# EasyEDA Pro project ProProject_基于CW32单片机的无刷电机控制器（旋转变压器位置反馈）_2024-06-02.epro, schematic Schematic2

## Sheets
1 P1_1: Create Date: 2024-05-21; Page Name: P1_1; Project Name: 基于CW32单片机的伺服电机控制器; Schematic Name: Schematic2; Update Date: 2024-05-25; Company: 嘉立创EDA; Page Size: A4; Version: V1.0
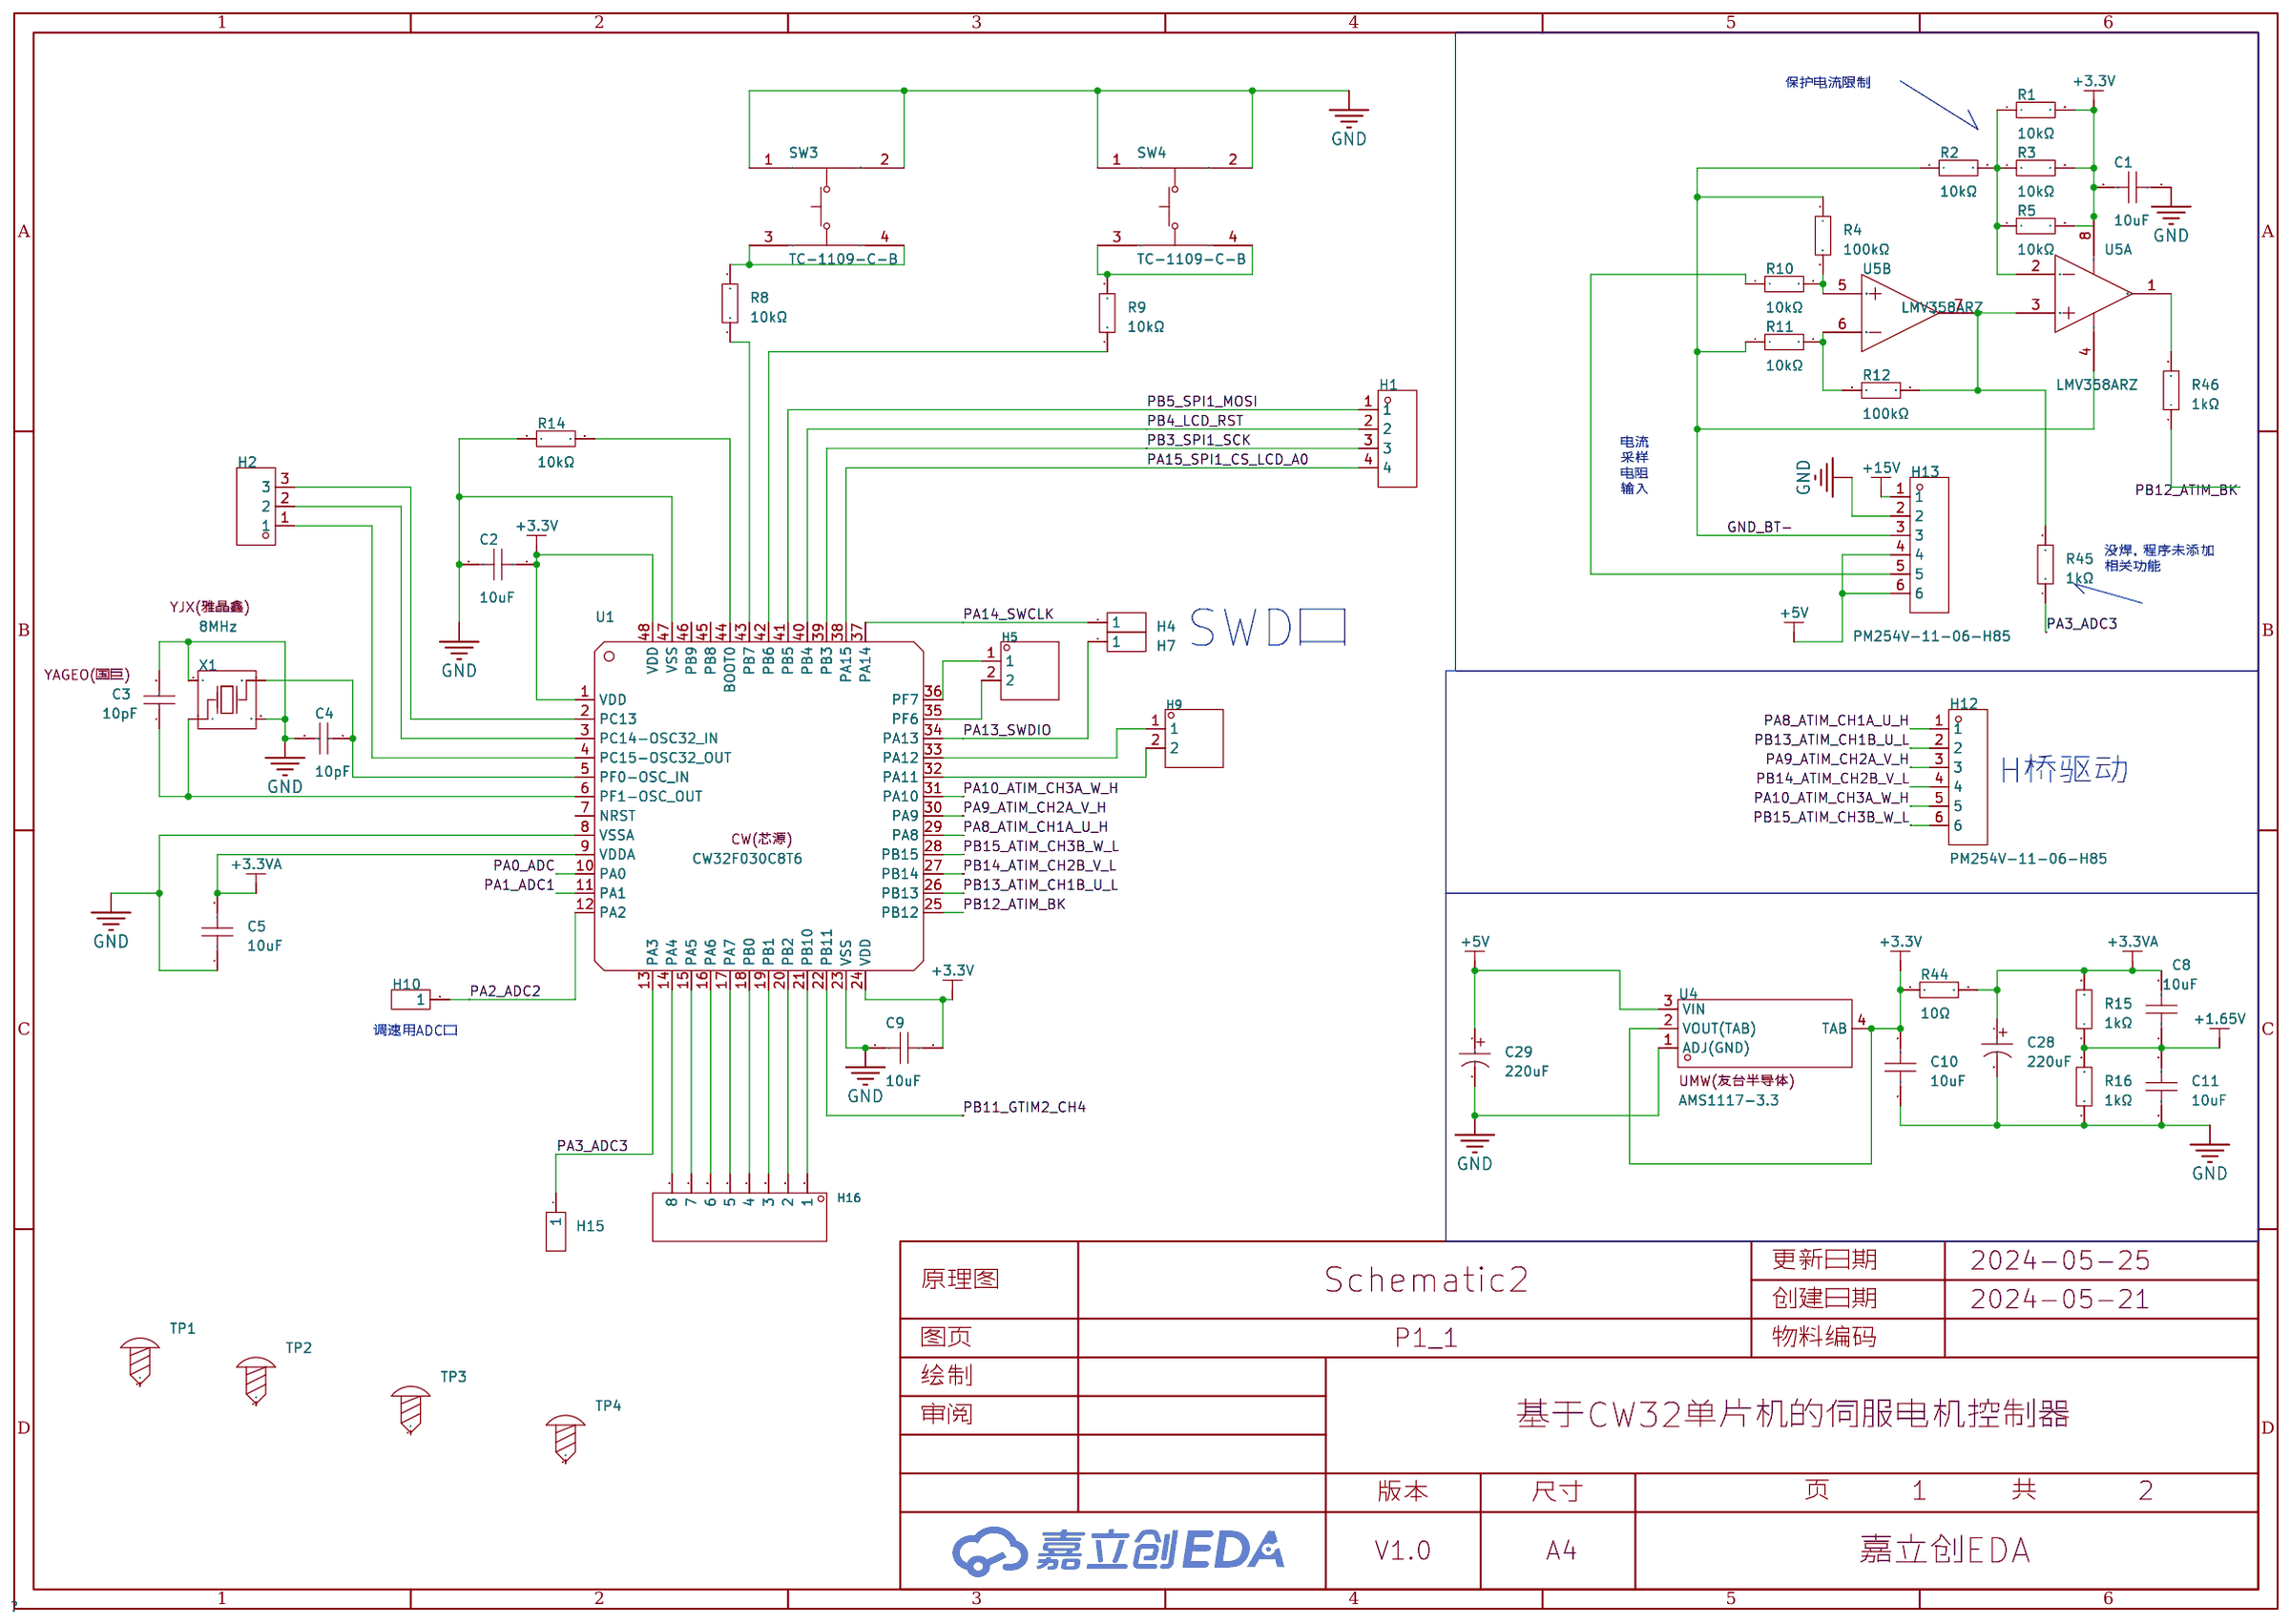
[diagram p0: P1_1]
2 P3: Create Date: 2024-05-25; Page Name: P3
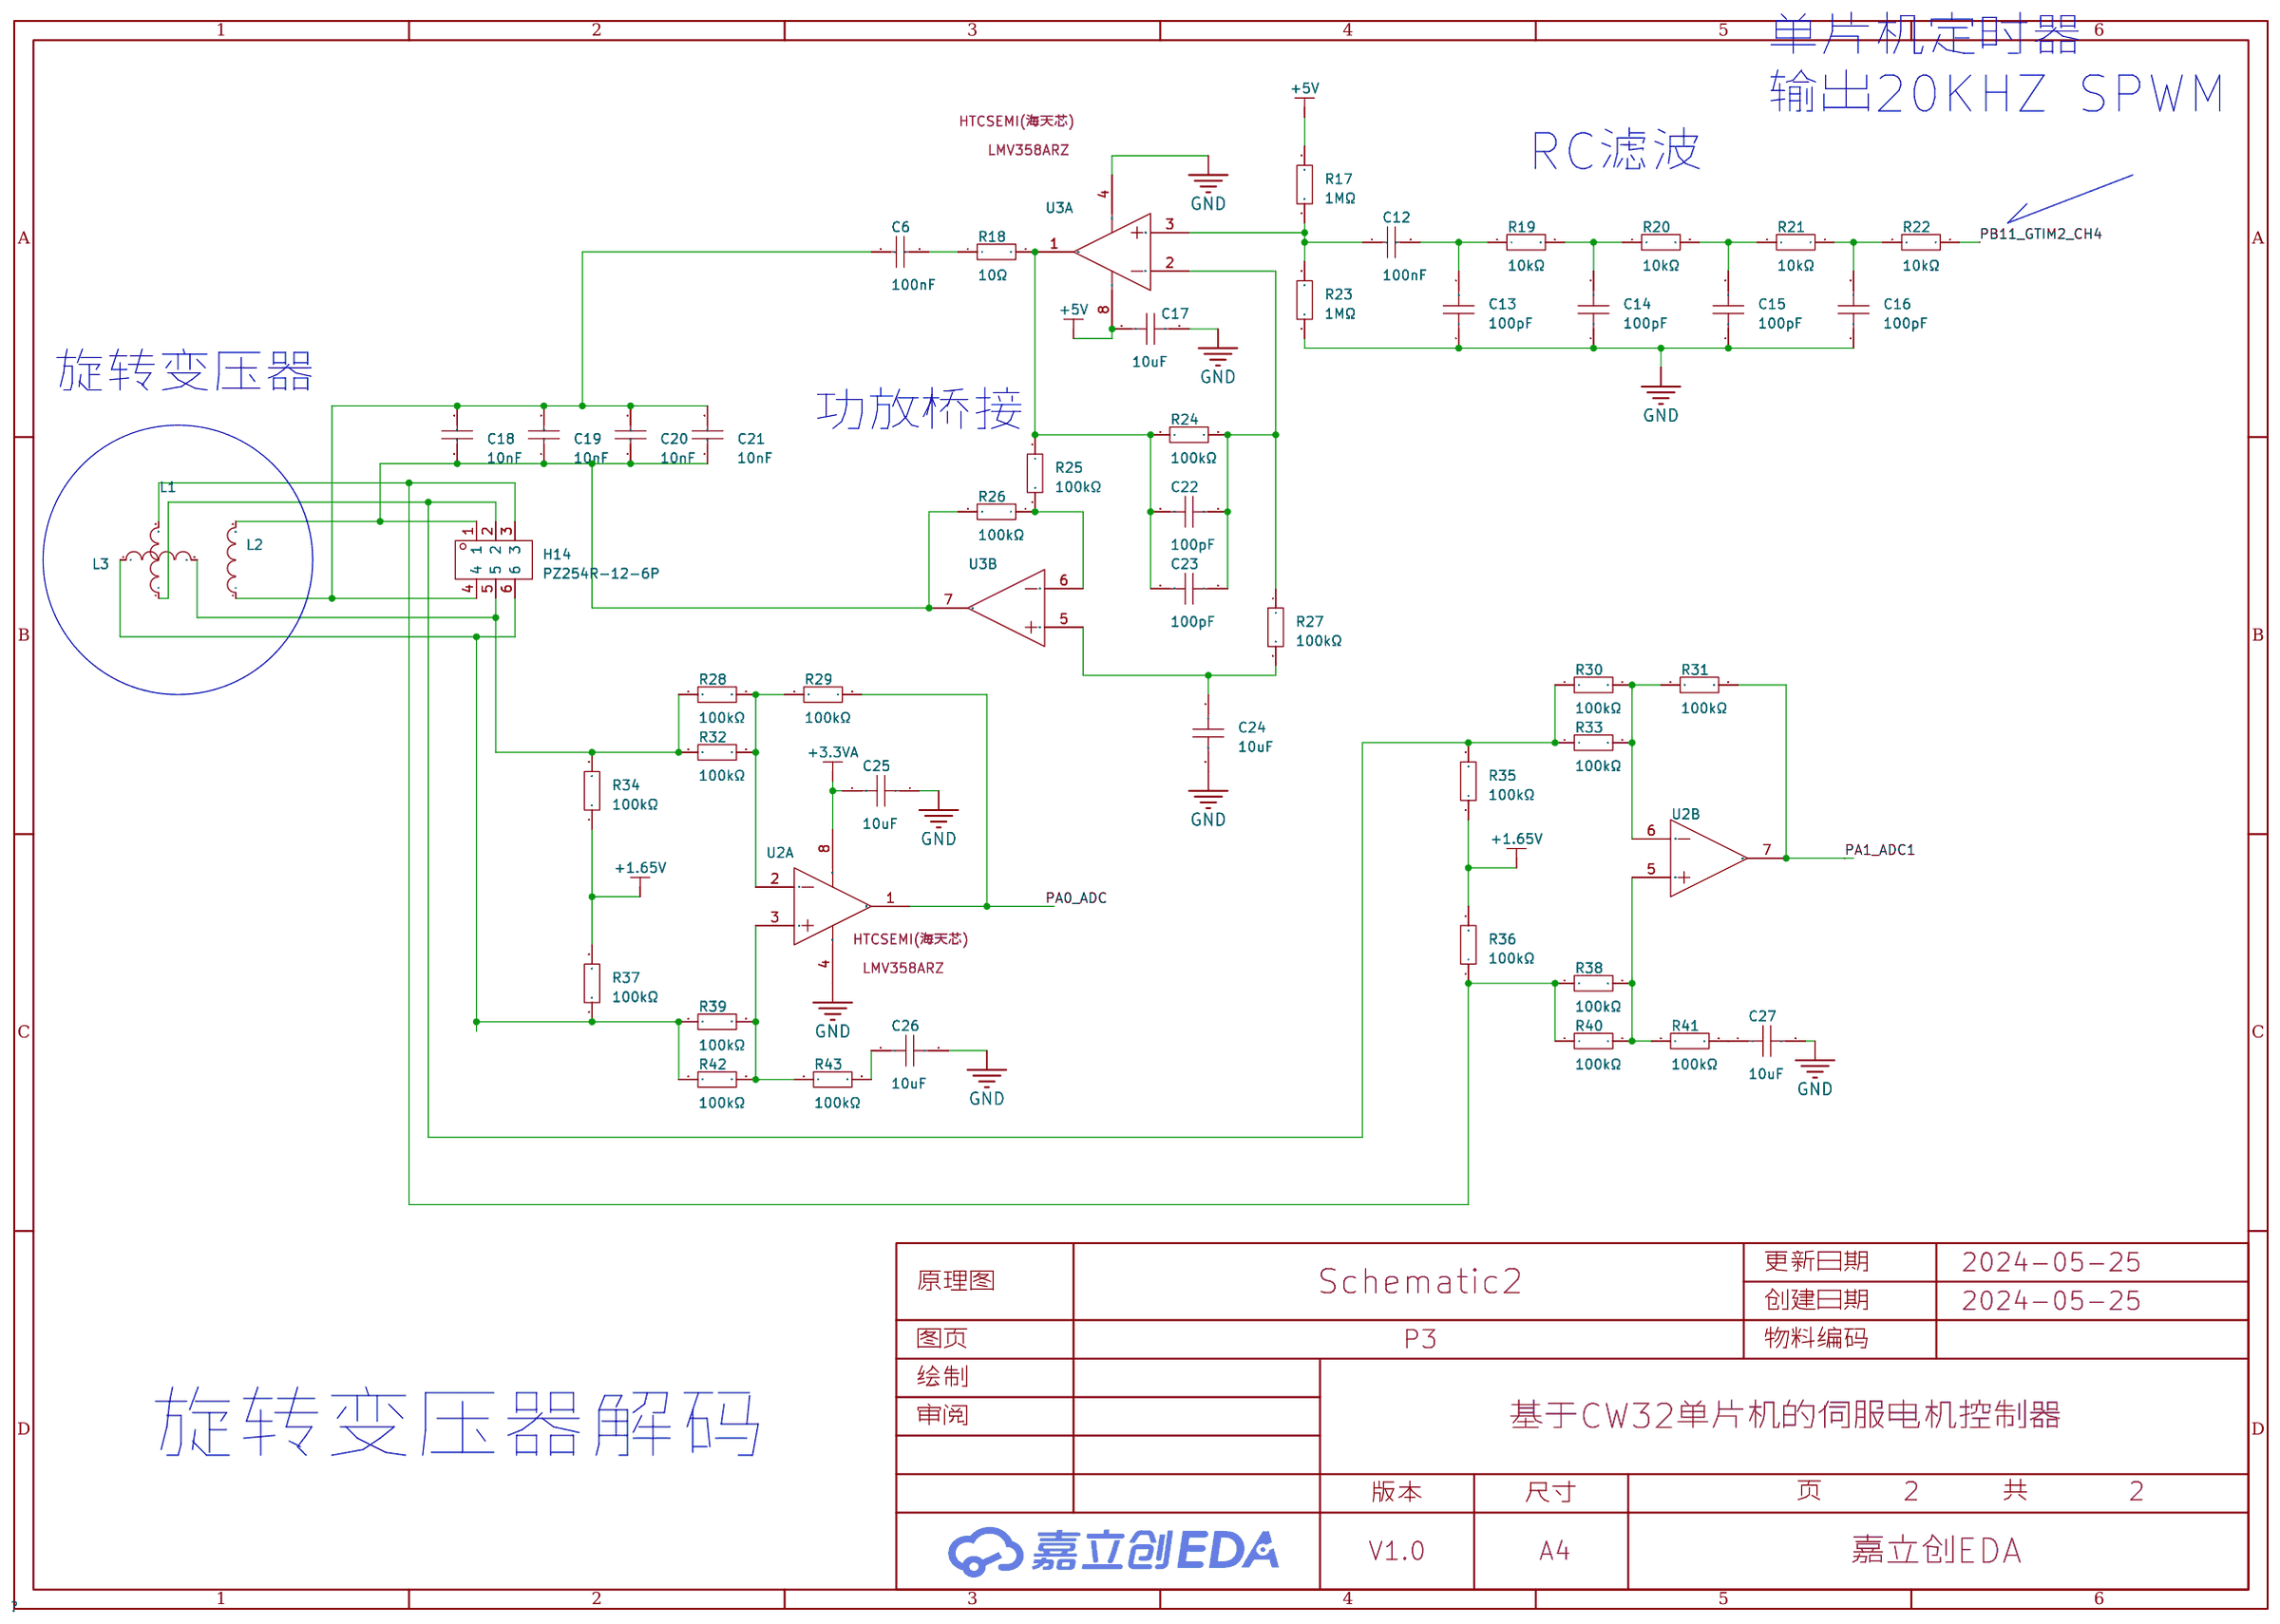
[diagram p1: P3]

## Parts
sheet P1_1
C1  10uF  [C0603]
C2  10uF  [C0603]
C3  10pF  [C0603]
C4  10pF  [C0603]
C5  10uF  [C0603]
C8  10uF  [C0603]
C9  10uF  [C0603]
C10  10uF  [C0603]
C11  10uF  [C0603]
C28  220uF  [CAP-SMD_BD6.3-L6.6-W6.6-LS7.2-R-RD]
C29  220uF  [CAP-SMD_BD6.3-L6.6-W6.6-LS7.2-R-RD]
H1  -  [HDR-TH_4P-P2.54-V-M]
H2  -  [HDR-TH_3P-P2.54-V-M]
H4  -  [HDR-TH_1P-V-M_XKB_X4611WV-01I-C28D40]
H5  -  [HDR-TH_2P-P2.54-V-M-1]
H7  -  [HDR-TH_1P-V-M_XKB_X4611WV-01I-C28D40]
H9  -  [HDR-TH_2P-P2.54-V-M-1]
H10  -  [HDR-TH_1P-V-M_XKB_X4611WV-01I-C28D40]
H12  PM254V-11-06-H85  [HDR-TH_6P-P2.54-V-F]
H13  PM254V-11-06-H85  [HDR-TH_6P-P2.54-V-F]
H15  -  [HDR-TH_1P-V-M_XKB_X4611WV-01I-C28D40]
H16  -  [HDR-TH_8P-P2.54-V-M]
R1  10kΩ  [R0603]
R2  10kΩ  [R0603]
R3  10kΩ  [R0603]
R4  100kΩ  [R0603]
R5  10kΩ  [R0603]
R8  10kΩ  [R0603]
R9  10kΩ  [R0603]
R10  10kΩ  [R0603]
R11  10kΩ  [R0603]
R12  100kΩ  [R0603]
R14  10kΩ  [R0603]
R15  1kΩ  [R0603]
R16  1kΩ  [R0603]
R44  10Ω  [R0603]
R45  1kΩ  [R0603]
R46  1kΩ  [R0603]
SW3  TC-1109-C-B  [KEY-TH_4P-L4.5-W4.5-P3.00-LS5.8]
SW4  TC-1109-C-B  [KEY-TH_4P-L4.5-W4.5-P3.00-LS5.8]
TP1  -  [M3螺丝]
TP2  -  [M3螺丝]
TP3  -  [M3螺丝]
TP4  -  [M3螺丝]
U1  CW32F030C8T6  [LQFP-48_L7.0-W7.0-P0.50-LS9.0-TL]
U4  AMS1117-3.3  [SOT-223-4_L6.5-W3.5-P2.30-LS7.0-BR]
U5  LMV358ARZ  [SOP-8_L4.9-W3.9-P1.27-LS6.0-BL]  (sections 1,2)
X1  8MHz  [OSC-SMD_4P-L3.2-W2.5-BL]
sheet P3
C6  100nF  [C0603]
C12  100nF  [C0603]
C13  100pF  [C0603]
C14  100pF  [C0603]
C15  100pF  [C0603]
C16  100pF  [C0603]
C17  10uF  [C0603]
C18  10nF  [C0603]
C19  10nF  [C0603]
C20  10nF  [C0603]
C21  10nF  [C0603]
C22  100pF  [C0603]
C23  100pF  [C0603]
C24  10uF  [C0603]
C25  10uF  [C0603]
C26  10uF  [C0603]
C27  10uF  [C0603]
H14  PZ254R-12-6P  [HDR-TH_6P-P2.54-H-M-R2-C3-S2.54]
L1  10uH  [L1206]
L2  6.3uH  [L1206]
L3  10uH  [L1206]
R17  1MΩ  [R0603]
R18  10Ω  [R0603]
R19  10kΩ  [R0603]
R20  10kΩ  [R0603]
R21  10kΩ  [R0603]
R22  10kΩ  [R0603]
R23  1MΩ  [R0603]
R24  100kΩ  [R0603]
R25  100kΩ  [R0603]
R26  100kΩ  [R0603]
R27  100kΩ  [R0603]
R28  100kΩ  [R0603]
R29  100kΩ  [R0603]
R30  100kΩ  [R0603]
R31  100kΩ  [R0603]
R32  100kΩ  [R0603]
R33  100kΩ  [R0603]
R34  100kΩ  [R0603]
R35  100kΩ  [R0603]
R36  100kΩ  [R0603]
R37  100kΩ  [R0603]
R38  100kΩ  [R0603]
R39  100kΩ  [R0603]
R40  100kΩ  [R0603]
R41  100kΩ  [R0603]
R42  100kΩ  [R0603]
R43  100kΩ  [R0603]
U2  -  [SOP-8_L4.9-W3.9-P1.27-LS6.0-BL]  (sections 1,2)
U3  -  [SOP-8_L4.9-W3.9-P1.27-LS6.0-BL]  (sections 1,2)

## Library data of the parts
C1 C2 C5 C8-C11 C17 C24-C27 = CL10A106KP8NNNC: 容值:10uF;精度:±10%;额定电压:10V;材质(温度系数):X5R;; LCSC Part Name: 10uF ±10% 10V; Supplier Part: C19702; Manufacturer: SAMSUNG(三星); Supplier Footprint: 0603; JLCPCB Part Class: 基础库; Datasheet: https://atta.szlcsc.com/upload/public/pdf/source/20160218/1457707763339.pdf; Supplier: LCSC; Tolerance: ±10%; Voltage Rated: 10V; Temperature Coefficient: X5R
C3 C4 = CC0603JRNPO9BN100: 容值:10pF;精度:±5%;额定电压:50V;材质(温度系数):NP0;; LCSC Part Name: 10pF ±5% 50V; Supplier Part: C106245; Manufacturer: YAGEO(国巨); Supplier Footprint: 0603; JLCPCB Part Class: 扩展库; Datasheet: https://atta.szlcsc.com/upload/public/pdf/source/20170505/1493957838062.pdf; Supplier: LCSC; Tolerance: ±5%; Voltage Rated: 50V; Temperature Coefficient: NP0
C28 C29 = RVT1A221M0605: 容值:220uF;精度:±20%;额定电压:10V;纹波电流:-;等效串联电阻:-;; LCSC Part Name: 220uF ±20% 10V; Supplier Part: C3345; Manufacturer: HONOR(荣誉); Supplier Footprint: SMD,D6.3xL5.4mm; JLCPCB Part Class: 扩展库; Datasheet: https://atta.szlcsc.com/upload/public/pdf/source/20220520/1BCC52842751E84E020A4D0B70BC5F88.pdf; Supplier: LCSC; Tolerance: ±20%; Rated Voltage: 10V; φD: 6.3mm; L: 5.4mm; Lifetime @ Temp: 2000hrs@105℃; Operating Temperature: -55℃~+105℃
H1 = HDR-M_2.54_1x4P: Supplier Part: C492403; Supplier Footprint: 插件
H2 = HDR-M_2.54_1x3P: Supplier Part: C2937625; Supplier Footprint: 插件
H4 H7 H10 H15 = HDR-M_2.54_1x1P: Supplier Part: C81276; Supplier Footprint: 插件; JLCPCB Part Class: Extended Part
H5 H9 = HDR-M_2.54_1x2P: Supplier Part: C124375; Supplier Footprint: 插件
H12 H13 = PM254V-11-06-H85: 插孔结构:1x6P;间距:2.54mm;行距:-;圆孔/方孔:方孔;安装类型:直插;排数:单排;总孔位数:6P;额定电流:3A;额定电压:250V;插孔方向:顶部;塑高:-;工作温度范围:-40℃~+105℃;; LCSC Part Name: 间距:2.54mm 1x6P 直插; Supplier Part: C2832269; Manufacturer: XFCN(兴飞); Supplier Footprint: 插件,P=2.54mm; JLCPCB Part Class: 扩展库; Datasheet: https://atta.szlcsc.com/upload/public/pdf/source/20210514/C2832269_B3EC97736B37C2783BDCE3050AA57447.pdf; Supplier: LCSC; Holes Structure: 1x6P; Pitch: 2.54mm; Circular Hole / Square Hole: 方孔; Mounting Type: 直插; Number of Rows: 单排; Number of Holes: 6P; Current Rating (Max): 3A; Voltage Rating (Max): 250V; Holes Direction: 顶部; Operating Temperature Range: -40℃~+105℃
H16 = HDR-M_2.54_1x8P: Supplier Part: C124381; Supplier Footprint: 插件
R1-R3 R5 R8-R11 R14 R19-R22 = RC0603FR-0710KL: 电阻类型:厚膜电阻;阻值:10kΩ;精度:±1%;功率:100mW;最大工作电压:75V;温度系数:±100ppm/℃;; LCSC Part Name: 厚膜电阻 10kΩ ±1% 100mW; Supplier Part: C98220; Manufacturer: YAGEO(国巨); Supplier Footprint: 0603; JLCPCB Part Class: 扩展库; Datasheet: https://atta.szlcsc.com/upload/public/pdf/source/20180927/C295883_E8D83085EA81BD7DE0B2B681138C15EE.pdf; Supplier: LCSC; Type: 厚膜电阻; Tolerance: ±1%; Power(Watts): 100mW; Overload Voltage (Max): 75V; Temperature Coefficient: ±100ppm/℃; Operating Temperature Range: -55℃~+155℃
R4 R12 R24-R43 = RC0603FR-07100KL: 电阻类型:厚膜电阻;阻值:100kΩ;精度:±1%;功率:100mW;最大工作电压:75V;温度系数:±100ppm/℃;; LCSC Part Name: 厚膜电阻 100kΩ ±1% 100mW; Supplier Part: C14675; Manufacturer: YAGEO(国巨); Supplier Footprint: 0603; JLCPCB Part Class: 扩展库; Datasheet: https://atta.szlcsc.com/upload/public/pdf/source/20140324/1457707028752.pdf; Supplier: LCSC; Type: 厚膜电阻; Tolerance: ±1%; Power(Watts): 100mW; Overload Voltage (Max): 75V; Temperature Coefficient: ±100ppm/℃; Operating Temperature Range: -55℃~+155℃
R15 R16 R45 R46 = RC0603FR-071KL: 电阻类型:厚膜电阻;阻值:1kΩ;精度:±1%;功率:100mW;最大工作电压:75V;温度系数:±100ppm/℃;; LCSC Part Name: 厚膜电阻 1kΩ ±1% 100mW; Supplier Part: C22548; Manufacturer: YAGEO(国巨); Supplier Footprint: 0603; JLCPCB Part Class: 扩展库; Datasheet: https://atta.szlcsc.com/upload/public/pdf/source/20180316/70C0E2BDAE7FCC62C531A5A58D202EE1.pdf; Supplier: LCSC; Type: 厚膜电阻; Tolerance: ±1%; Power(Watts): 100mW; Overload Voltage (Max): 75V; Temperature Coefficient: ±100ppm/℃; Operating Temperature Range: -55℃~+155℃
R18 R44 = 0603WAF100JT5E: 电阻类型:厚膜电阻;阻值:10Ω;精度:±1%;功率:100mW;最大工作电压:75V;温度系数:±400ppm/℃;; LCSC Part Name: 10Ω ±1% 100mW 厚膜电阻; Supplier Part: C22859; Manufacturer: UNI-ROYAL(厚声); Supplier Footprint: 0603; JLCPCB Part Class: 基础库; Datasheet: https://atta.szlcsc.com/upload/public/pdf/source/20200306/C422600_1E6D84923E4A46A82E41ADD87F860B5C.pdf; Supplier: LCSC; Type: 厚膜电阻; Tolerance: ±1%; Power(Watts): 100mW; Overload Voltage (Max): 75V; Temperature Coefficient: ±400ppm/℃; Operating Temperature Range: -55℃~+155℃
SW3 SW4 = TC-1109-C-B: 电路结构:单刀单掷;按钮形状:圆形按钮;作用力:260gf;安装方式:直插;开关长度:4.5mm;开关宽度:4.5mm;开关高度:4.3mm;带支架:不带;触点电流:50mA;额定电压(DC):12V;绝缘电阻:-;带灯:无;机械寿命:10万次;; LCSC Part Name: 4.5*4.5*4.3mm 直插 轻触开关; Supplier Part: C381028; Manufacturer: XKB Connectivity(中国星坤); Supplier Footprint: 插件; JLCPCB Part Class: 扩展库; Datasheet: https://atta.szlcsc.com/upload/public/pdf/source/20200227/C381029_60190E4BA5E8CCEE2F9455ADEE779639.pdf; Supplier: LCSC; Circuit: 单刀单掷; Actuator Style: 圆形按钮; Operating Force: 260gf; Mounting Style: 直插; Switch Length: 4.5mm; Switch Width: 4.5mm; Switch Height: 4.3mm; Strike Gundam: 不带; Contact Current: 50mA; Voltage Rating (DC): 12V; Actuator/Cap Color: 黑色; With Lamp: 无; Pin Style: PC引脚; Mechanical Life: 10万次; Operating Temperature: -30℃~+85℃
TP1-TP4 = M3螺丝: Supplier Footprint: 插件
U1 = CW32F030C8T6_C3019113: CPU内核:ARM-M系列;RAM总容量:8KB;GPIO端口数量:39;工作电压范围:1.65V~5.5V;CPU最大主频:64MHz;程序存储器类型:-;; Supplier Part: C3019113; Manufacturer: CW(芯源); Supplier Footprint: LQFP-48(7x7); JLCPCB Part Class: 扩展库; Datasheet: https://atta.szlcsc.com/upload/public/pdf/source/20220516/D60F5E1023A73FFF550D4A77416DDFBC.pdf; Supplier: LCSC; CPU Core: ARM-M系列; RAM Size: 8KB; GPIO Ports Number: 39; Operating Voltage Range: 1.65V~5.5V; CPU Maximum Speed: 64MHz; Operating Temperature Range: -40℃~+105℃; ADC (Bit): 12bit; 16Bit Timer: 8; UART/USART: 3; I2C: 2; SPI: 2; Internal Comparator: 有; Peripheral/Function: 片载温度传感器；DMA；看门狗；低电压检测；CRC校验; Watchdog: 有; Low-Voltage Detect: 有; Direct Memory Access: 有
U4 = AMS1117-3.3_C347222: 输出类型:固定;最大输入电压:12V;输出电压:3.3V;最大输出电流:1A;电源纹波抑制比(PSRR):60dB@(120Hz);输出极性:正极;; LCSC Part Name: 输出:3.3V 电流:1A 耐压:12V; Supplier Part: C347222; Manufacturer: UMW(友台半导体); Supplier Footprint: SOT-223; JLCPCB Part Class: 扩展库; Datasheet: https://atta.szlcsc.com/upload/public/pdf/source/20231109/155D79A26D9DB04352555A58D5969DC8.pdf; Supplier: LCSC; Output Type: 固定; Maximum Input Voltage: 12V; Output Voltage: 3.3V; MAX Output Current: 1A; Power Supply Rejection Ratio (PSRR): 60dB@(120Hz); Dropout Voltage: 1.3V@(1A); Output Polarity: 正极; Number of Outputs: 1
U2 U3 U5 = LMV358ARZ: 放大器数:双路;; Supplier Part: C2928823; Manufacturer: HTCSEMI(海天芯); Supplier Footprint: SOP-8; JLCPCB Part Class: 扩展库; Datasheet: https://atta.szlcsc.com/upload/public/pdf/source/20220114/2D4B849A76DE33264688A93B3A90A0F8.pdf; Supplier: LCSC; Number of Circuits: 双路
X1 = TAXM8M4RDBCCT2T: 晶振类型:贴片晶振;频率:8MHz;常温频差:±10ppm;外接负载电容:10pF;频率稳定度(全温):±15ppm;; LCSC Part Name: 8MHz ±10ppm 10pF; Supplier Part: C400090; Manufacturer: YJX(雅晶鑫); Supplier Footprint: SMD3225-4P; JLCPCB Part Class: 扩展库; Datasheet: https://atta.szlcsc.com/upload/public/pdf/source/20190626/C400090_CF95B89E745AFE4EF2E392EF8AC009D6.pdf; Supplier: LCSC; Crystal Type: 贴片晶振; Normal temperature Frequency Tolerance: ±10ppm; External load capacitor: 10pF; Frequency Stability(Full temperature range): ±15ppm; Equivalent Series Resistance (ESR): 250Ω; Operating Temperature: -40℃~+85℃
C6 C12 = 0603B104K500NT: 容值:100nF;精度:±10%;额定电压:50V;材质(温度系数):X7R;; LCSC Part Name: 100nF ±10% 50V; Supplier Part: C30926; Manufacturer: FH(风华); Supplier Footprint: 0603; JLCPCB Part Class: 扩展库; Datasheet: https://atta.szlcsc.com/upload/public/pdf/source/20200305/C486355_26A10D38EF8C2A5C37091D0039909270.pdf; Supplier: LCSC; Tolerance: ±10%; Voltage Rated: 50V; Temperature Coefficient: X7R
C13-C16 C22 C23 = CC0603JRNPO9BN101: 容值:100pF;精度:±5%;额定电压:50V;材质(温度系数):NP0;; LCSC Part Name: 100pF ±5% 50V; Supplier Part: C14665; Manufacturer: YAGEO(国巨); Supplier Footprint: 0603; JLCPCB Part Class: Extended Part; Datasheet: https://atta.szlcsc.com/upload/public/pdf/source/20181008/C309499_21CC21451B82C39E3D92150FD6B30293.pdf; Supplier: LCSC; Tolerance: ±5%; Voltage Rated: 50V; Temperature Coefficient: NP0
C18-C21 = CC0603KRX7R9BB103: 容值:10nF;精度:±10%;额定电压:50V;材质(温度系数):X7R;; LCSC Part Name: 10nF ±10% 50V; Supplier Part: C100042; Manufacturer: YAGEO(国巨); Supplier Footprint: 0603; JLCPCB Part Class: 扩展库; Datasheet: https://atta.szlcsc.com/upload/public/pdf/source/20181008/C309510_22F155564471FAF6A489F7D68F34234E.pdf; Supplier: LCSC; Tolerance: ±10%; Voltage Rated: 50V; Temperature Coefficient: X7R
H14 = PZ254R-12-6P: 插针结构:2x3P;间距:2.54mm;行距:2.54mm;圆针/方针:方针;安装类型:弯插;排数:双排;总PIN位数:6P;额定电流:-;额定电压:-;配合针长度:6mm;塑高:2.5mm;触头材质:黄铜;触头镀层:-;工作温度范围:-40℃~+105℃;颜色:黑色;; LCSC Part Name: 间距:2.54mm 2x3P 弯插 方针; Supplier Part: C492431; Manufacturer: XFCN(兴飞); Supplier Footprint: 弯插,P=2.54mm; JLCPCB Part Class: 扩展库; Datasheet: https://atta.szlcsc.com/upload/public/pdf/source/20200309/C492431_963045AB4FEE5C8F9F90C5FCD3C14DF0.pdf; Supplier: LCSC; Pin Structure: 2x3P; Pitch: 2.54mm; Row Spacing: 2.54mm; Circluar Pins/Square Pins: 方针; Mounting Type: 弯插; Number of Rows: 双排; Number of Pins: 6P; Length of Mating Pin: 6mm; Insulation Height: 2.5mm; Contact Material: 黄铜; Operating Temperature Range: -40℃~+105℃; Color: 黑色
L1-L3 = L_1206
R17 R23 = 0603WAF1004T5E: 电阻类型:厚膜电阻;阻值:1MΩ;精度:±1%;功率:100mW;; LCSC Part Name: 1MΩ±1%100mW; Supplier Part: C22935; Manufacturer: UNI-ROYAL(厚声); Supplier Footprint: 0603; JLCPCB Part Class: BasicPart; Datasheet: https://atta.szlcsc.com/upload/public/pdf/source/20200306/C422600_1E6D84923E4A46A82E41ADD87F860B5C.pdf; Supplier: LCSC; Type: 厚膜电阻; Tolerance: ±1%; Power(Watts): 100mW; Temperature Coefficient: ±100ppm/℃; Overload Voltage (Max): 75V; Operating Temperature Range: -55℃~+155℃

## Nets
+1.65V: C8.1 C11.2 R15.1 R16.2 R34.1 R35.1 R36.2 R37.2
+3.3V: C1.2 C2.1 C9.2 C10.2 R1.2 R3.2 R5.2 R44.1 U1.1(VDD) U1.24(VDD) U1.48(VDD) U4.2(VOUT(TAB)) U4.4(TAB) U5.8(VCC)
+3.3VA: C5.2 C8.2 C25.2 C28.1 R15.2 R44.2 U1.9(VDDA) U2.8(VCC)
+5V: C17.2 C29.1 H13.4 H13.6 R17.2 U3.8(VCC) U4.3(VIN)
+15V: H13.1
GND: C1.1 C2.2 C3.2 C4.1 C5.1 C9.1 C10.1 C11.1 C13.1 C14.1 C15.1 C16.1 C17.1 C24.2 C25.1 C26.2 C27.2 C28.2 C29.2 H13.2 R14.1 R16.1 R23.1 SW3.1 SW3.2 SW4.1 SW4.2 U1.8(VSSA) U1.23(VSS) U1.47(VSS) U2.4(GND) U3.4(GND) U4.1(ADJ(GND)) X1.2 X1.4
GND_BT-: H13.3 R2.1 R4.1 R11.1 U5.4(GND)
PA0_ADC: R29.2 U1.10(PA0) U2.1(OUT)
PA1_ADC1: R31.2 U1.11(PA1) U2.7(OUT2)
PA2_ADC2: H10.1 U1.12(PA2)
PA3_ADC3: H15.1 R45.1 U1.13(PA3)
PA8_ATIM_CH1A_U_H: H12.1 U1.29(PA8)
PA9_ATIM_CH2A_V_H: H12.3 U1.30(PA9)
PA10_ATIM_CH3A_W_H: H12.5 U1.31(PA10)
PA13_SWDIO: H7.1 U1.34(PA13)
PA14_SWCLK: H4.1 U1.37(PA14)
PA15_SPI1_CS_LCD_A0: H1.4 U1.38(PA15)
PB3_SPI1_SCK: H1.3 U1.39(PB3)
PB4_LCD_RST: H1.2 U1.40(PB4)
PB5_SPI1_MOSI: H1.1 U1.41(PB5)
PB11_GTIM2_CH4: R22.2 U1.22(PB11)
PB12_ATIM_BK: R46.1 U1.25(PB12)
PB13_ATIM_CH1B_U_L: H12.2 U1.26(PB13)
PB14_ATIM_CH2B_V_L: H12.4 U1.27(PB14)
PB15_ATIM_CH3B_W_L: H12.6 U1.28(PB15)
$3N1046: C4.2 U1.5(PF0-OSC_IN) X1.3
$3N1253: C3.1 U1.6(PF1-OSC_OUT) X1.1
$3N1416: R14.2 U1.44(BOOT0)
$3N1882: R8.1 U1.43(PB7)
$3N1886: R9.1 U1.42(PB6)
$3N6202: H16.1 U1.21(PB10)
$3N6205: H16.2 U1.20(PB2)
$3N6208: H16.3 U1.19(PB1)
$3N6214: H16.4 U1.18(PB0)
$3N6221: H16.5 U1.17(PA7)
$3N6224: H16.6 U1.16(PA6)
$3N6227: H16.7 U1.15(PA5)
$3N6233: H16.8 U1.14(PA4)
$3N9618: R8.2 SW3.3 SW3.4
$3N9625: R9.2 SW4.3 SW4.4
$3N13394: R4.2 R10.2 U5.5(IN2+)
$3N13395: R11.2 R12.1 U5.6(IN2-)
$3N13400: R1.1 R2.2 R3.1 R5.1 U5.2(IN1-)
$3N13416: R46.2 U5.1(OUT)
$3N18094: H13.5 R10.1
$3N21169: R12.2 R45.2 U5.3(IN1+) U5.7(OUT2)
$5N2241: C14.2 R19.2 R20.1
$5N2242: C15.2 R20.2 R21.1
$5N2243: C16.2 R21.2 R22.1
$5N2244: C12.2 C13.2 R19.1
$5N2255: C12.1 R17.1 R23.2 U3.3(IN1+)
$5N2259: R25.2 R26.1 U3.6(IN2-)
$5N2266: R28.2 R29.1 R32.2 U2.2(IN1-)
$5N2267: R39.2 R42.2 R43.1 U2.3(IN1+)
$5N2269: C26.1 R43.2
$5N2271: C27.1 R41.2
$5N2272: R30.2 R31.1 R33.2 U2.6(IN2-)
$5N2273: R38.2 R40.2 R41.1 U2.5(IN2+)
$5N2844: C24.1 R27.2 U3.5(IN2+)
$5N5792: C22.2 C23.2 R18.2 R24.1 R25.1 U3.1(OUT)
$5N5806: C22.1 C23.1 R24.2 R27.1 U3.2(IN1-)
$5N5964: C6.2 R18.1
Net-(C6-1): C6.1 C18.2 C19.2 C20.2 C21.2 H14.4 L2.1
Net-(C18-1): C18.1 C19.1 C20.1 C21.1 H14.1 L2.2 R26.2 U3.7(OUT2)
Net-(H2-1): H2.1 U1.4(PC15-OSC32_OUT)
Net-(H2-2): H2.2 U1.3(PC14-OSC32_IN)
Net-(H2-3): H2.3 U1.2(PC13)
Net-(H5-1): H5.1 U1.36(PF7)
Net-(H5-2): H5.2 U1.35(PF6)
Net-(H9-1): H9.1 U1.33(PA12)
Net-(H9-2): H9.2 U1.32(PA11)
Net-(H14-2): H14.2 L1.1 R30.1 R33.1 R35.2
Net-(H14-3): H14.3 L1.2 R36.1 R38.1 R40.1
Net-(H14-5): H14.5 L3.2 R28.1 R32.1 R34.2
Net-(H14-6): H14.6 L3.1 R37.1 R39.1 R42.1

Not connected (* = marked no-connect by the designer): TP1 1; TP2 1; TP3 1; TP4 1; U1 7(NRST) 45(PB8) 46(PB9)

## Notes on the sheets
sheet 1
- 保护电流限制
- 电流
  采样
  电阻
  输入
- 没焊，程序未添加
  相关功能
- SWD口
- H桥驱动
- 调速用ADC口
sheet 2
- 单片机定时器
  输出20KHZ SPWM
- RC滤波
- 旋转变压器
- 功放桥接
- 旋转变压器解码
